# EAGLE design Si4825_KIT_SMT (EAGLE 7.5.0)
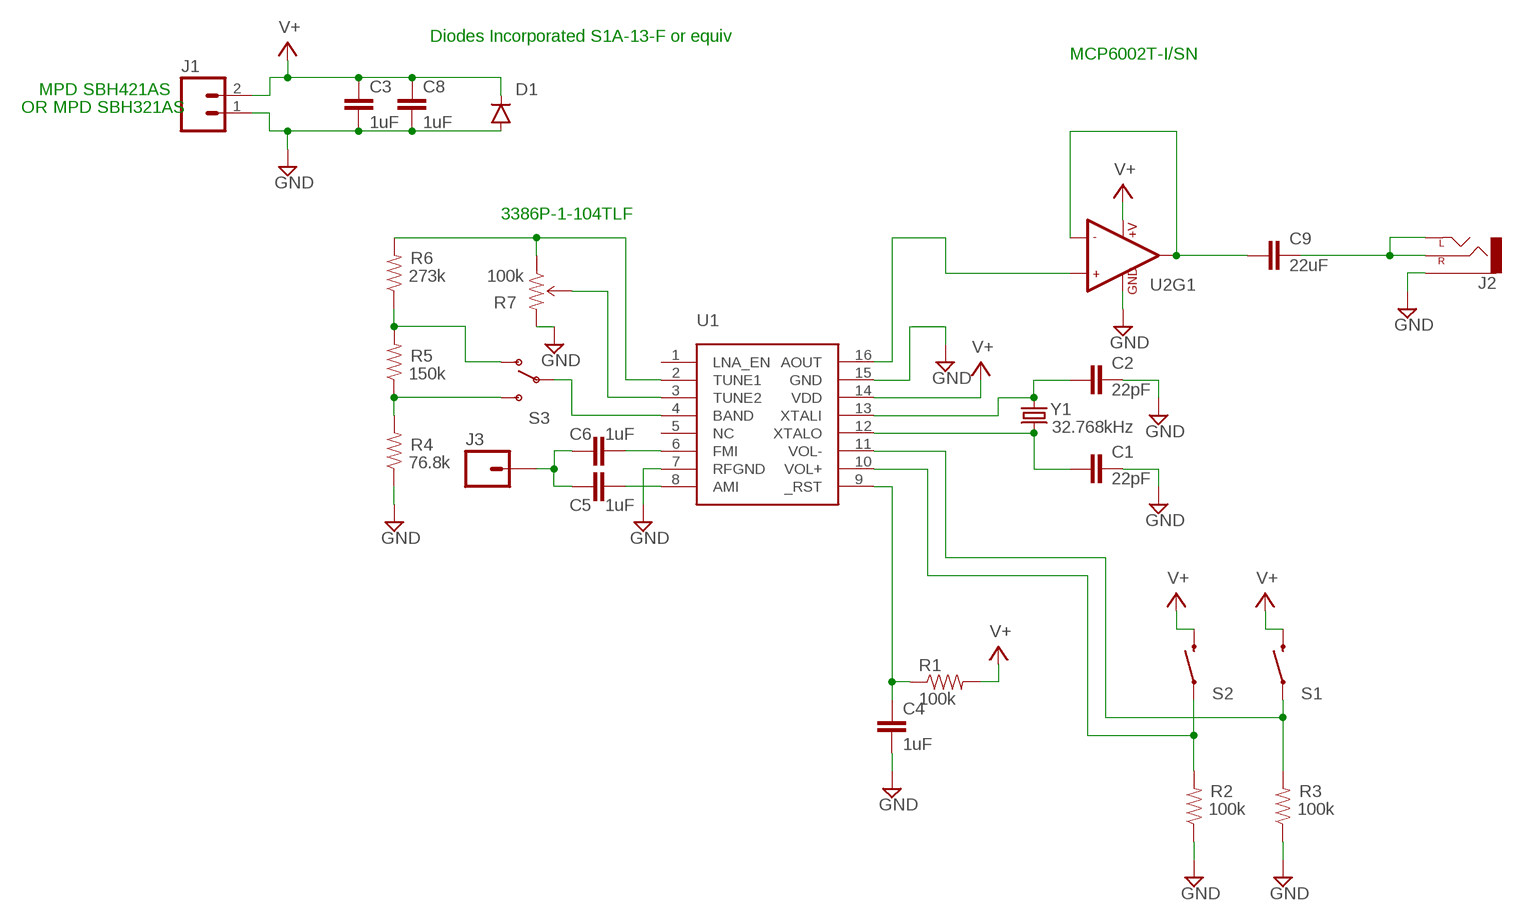
[diagram p0: schematic, sheet 1]

## Parts
C1  22pF  CAP0805  [0805]
C2  22pF  CAP0805  [0805]
C3  1uF  CAP0805  [0805]
C4  1uF  CAP0805  [0805]
C5  1uF  CAP0805  [0805]
C6  1uF  CAP0805  [0805]
C8  1uF  CAP0805  [0805]
C9  22uF  CAP0805  [0805]
D1  DIODESMA  [SMA-DIODE]
J1  M02PTH  [1X02]
J2  AUDIO-JACKPTH  [AUDIO-JACK]
J3  M01PTH  [1X01]
R1  100k  RESISTOR0805-RES  [0805]
R2  100k  RESISTOR0805-RES  [0805]
R3  100k  RESISTOR0805-RES  [0805]
R4  76.8k  RESISTOR0805-RES  [0805]
R5  150k  RESISTOR0805-RES  [0805]
R6  273k  RESISTOR0805-RES  [0805]
R7  100k  BOURNS_3386P  [BOURNS_3386P]
S1  SWITCH-MOMENTARY-2PTH  [TACTILE-PTH]
S2  SWITCH-MOMENTARY-2PTH  [TACTILE-PTH]
S3  SWITCH-SPDTPTH  [SWITCH-SPDT]
U1  SI4825  [SO16]
U2  LMV358SOIC  [SO08]
Y1  32.768kHz  CRYSTALTC26H  [TC26H]

## Nets
GND: C1.2 C2.2 C3.2 C4.2 C8.2 D1.A J1.1 J2.SLEEVE R2.1 R3.1 R4.1 R7.P$3(CW) U1.7(RFGND) U1.15(GND) U2.4(GND)
N$1: C5.2 U1.8(AMI)
N$2: C1.1 U1.12(XTALO) Y1.2
N$3: C2.1 U1.13(XTALI) Y1.1
N$4: C4.1 R1.1 U1.9(_RST)
N$5: R2.2 S2.1 U1.10(VOL+)
N$6: R3.2 S1.1 U1.11(VOL-)
N$7: S3.2(P) U1.4(BAND)
N$8: R4.2 R5.1 S3.3(S)
N$9: R5.2 R6.1 S3.1(O)
N$10: R6.2 R7.P$1(CCW) U1.2(TUNE1)
N$11: C6.2 U1.6(FMI)
N$12: R7.P$2(WIPER) U1.3(TUNE2)
N$13: C9.2 J2.RING(RIGHT) J2.TIP(LEFT)
N$14: U1.16(AOUT) U2.3(+IN1)
N$15: C5.1 C6.1 J3.1
N$17: C9.1 U2.1(OUT1) U2.2(-IN1)
V+: C3.1 C8.1 D1.C J1.2 R1.2 S1.3 S2.3 U1.14(VDD) U2.8(+V)
Unconnected: U1.1(LNA_EN) U1.5(NC) U2.5(+IN2) U2.6(-IN2) U2.7(OUT2)

## Notes on the sheet
- Diodes Incorporated S1A-13-F or equiv
- MCP6002T-I/SN
- MPD SBH421AS
- OR MPD SBH321AS
- 3386P-1-104TLF

## Library data of the parts
C1-C6 C8 C9 = SparkFun-Passives:CAP: Capacitor Standard 0603 ceramic capacitor, and 0.1" leaded capacitor.
D1 = SparkFun-DiscreteSemi:DIODE: Diode These are standard reverse protection diodes and small signal diodes. SMA package can handle up to about 1A. SOD-323 can handle about 200mA. What the SOD-323 package when ordering, there are some mfgs out there that are 5-pin packages.
J1 = SparkFun-Connectors:M02: Standard 2-pin 0.1" header. Use with - straight break away headers ( PRT-00116) - right angle break away headers (PRT-00553) - swiss pins (PRT-00743) - machine pins (PRT-00117) - female headers (PRT-00115) Molex polarized connector foot print use with: PRT-08233 with associated crimp pins and housings. 2.54_SCREWTERM for use with PRT-10571. 3.5mm Screw Terminal footprints for PRT-08084 5mm Screw Terminal footprints for use with PRT-08432
J2 = SparkFun-Connectors:AUDIO-JACK: 3.5mm Audio Jack Simple 3.5mm common PCB mount audio jack. Variant PTH is our storefront SKU PRT-08032
J3 = SparkFun-Connectors:M01: Header 1 Standard 1-pin 0.1" header. Use with straight break away headers (SKU : PRT-00116), right angle break away headers (PRT-00553), swiss pins (PRT-00743), machine pins (PRT-00117), and female headers (PRT-00115). SMTSO-256-ET is a "flush mount" nut for a 4-40 screw. The older package used to be too tight, and did not allow it to sit properly thru the drill hit. The latest (0.165DIA) fits nice and snug.
R1-R6 = SparkFun-Resistors:RESISTOR: Resistor Basic schematic elements and footprints for 0603, 1206, and PTH resistors.
R7 = Si4825:BOURNS_3386P
S1 S2 = SparkFun-Electromechanical:SWITCH-MOMENTARY-2: Various NO switches- pushbuttons, reed, etc; PROD_ID: SWCH-08441
S3 = SparkFun-Electromechanical:SWITCH-SPDT: SPDT Switch Simple slide switch, Spark Fun Electronics SKU : COM-00102 DPDT SMT slide switch, AYZ0202, SWCH-08179; PROD_ID: SWCH-08261
U1 = Si4825:SI4825
U2 = SparkFun-AnalogIC:LMV358: Jellybean rail-to-rail output op-amp; PROD_ID: IC-09657
Y1 = SparkFun-FreqCtrl:CRYSTAL: Various standard crystals. Proven footprints.; PROD_ID: XTAL-10112

## Board
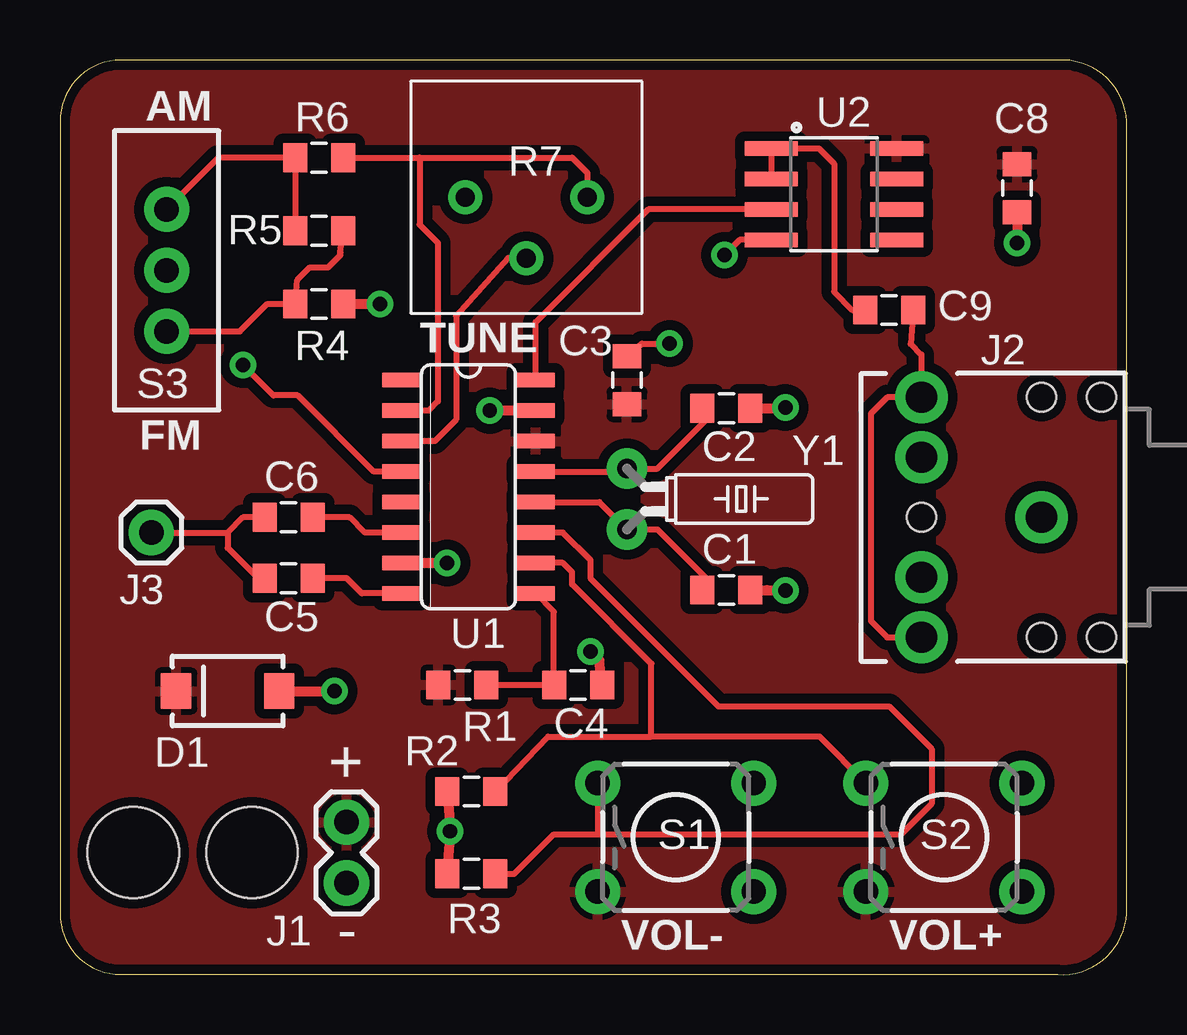
[diagram p1: board, top side]
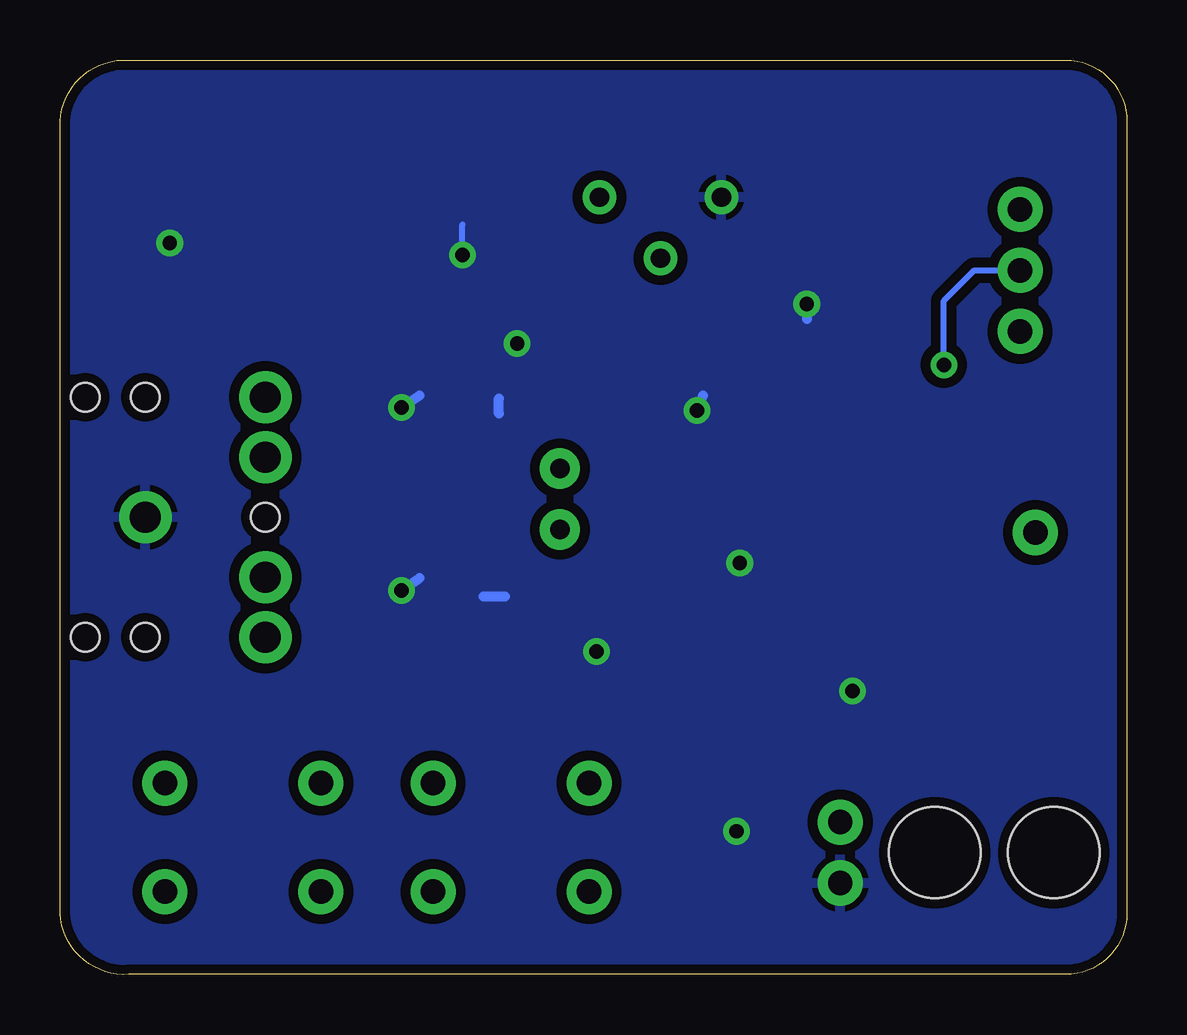
[diagram p2: board, bottom side, seen from below]

Size 44.45 x 38.11 mm. Coordinates in mm from the lower left corner, seen from the top.
Outline: 41.58,38.1 2.54,38.1 arc90 0,35.55 0,2.54 arc90 2.54,0 41.58,0 arc90 44.45,2.54 44.45,35.55 arc90 41.58,38.1
Copper layers (1*16): Top 0.035mm / dielectric 1.5mm / Bottom 0.035mm
Design rules "SparkFun": minimum track width 8mil, minimum drill 20mil, track to track 8mil, track to pad 8mil, pad to pad 8mil, via to via 8mil, smd to smd 8mil, copper to edge 10mil, drill to drill 8mil, minimum pad ring 12mil, minimum via ring 10mil, stop-mask expansion 4mil, vias tented up to drill 25mil, thermal gap 10mil
Holes 3.81 mm at 8,5.08 3.05,5.08

### Footprints (pad centres in the part's own frame; a part is rotated, then mirrored left to right if it is on the bottom)
0805 = smd 1 x 1.2: 1 -1,0; 2 1,0
SMA-DIODE = smd 1.27 x 1.47: A -2.15,0; C 2.15,0
1X02 = drill 1.016 pad 1.88: 1 0,0; 2 2.54,0
AUDIO-JACK = drill 1.3 pad 2.184: RING 5,5; RSH 5,2.5; SLEEVE 0,0; TIP 5,-5; TSH 5,-2.5 | hole 1.2: 0,5; -2.5,5; -2.5,-5; 0,-5; 5,0
1X01 = drill 1.016 pad 1.88: 1 0,0
BOURNS_3386P = drill 0.8: P$1 2.54,0; P$2 0,-2.54; P$3 -2.54,0
TACTILE-PTH = drill 1.016 pad 1.88: 1 -3.251,2.261; 2 3.251,2.261; 3 -3.251,-2.261; 4 3.251,-2.261
SWITCH-SPDT = drill 1.016 pad 1.88: 1 0,2.54; 2 0,0; 3 0,-2.54
SO16 = smd 0.6 x 1.6: 1 -4.445,-2.8; 2 -3.175,-2.8; 3 -1.905,-2.8; 4 -0.635,-2.8; 5 0.635,-2.8; 6 1.905,-2.8; 7 3.175,-2.8; 8 4.445,-2.8; 9 4.445,2.8; 10 3.175,2.8; 11 1.905,2.8; 12 0.635,2.8; 13 -0.635,2.8; 14 -1.905,2.8; 15 -3.175,2.8; 16 -4.445,2.8
SO08 = smd 0.61 x 2.21: 1 -1.905,-2.616; 2 -0.635,-2.616; 3 0.635,-2.616; 4 1.905,-2.616; 5 1.905,2.616; 6 0.635,2.616; 7 -0.635,2.616; 8 -1.905,2.616
TC26H = drill 0.813 pad 1.676: 1 -1.27,0; 2 1.27,0

### Placement (x,y rotation side)
C1  27.77,16.02 0 top
C2  27.77,23.6 0 top
C3  23.62,24.77 90 top
C4  21.59,12.07 0 top
C5  9.53,16.51 0 top
C6  9.53,19.05 0 top
C8  39.88,32.77 270 top
C9  34.54,27.69 0 top
D1  6.99,11.81 180 top
J1  11.94,3.81 90 top
J2  40.89,19.05 180 top
J3  3.81,18.42 0 top
R1  16.76,12.07 180 top
R2  17.14,7.62 0 top
R3  17.14,4.19 0 top
R4  10.79,27.94 180 top
R5  10.79,30.99 180 top
R6  10.79,34.04 0 top
R7  19.43,32.39 0 top
S1  25.65,5.72 0 top
S2  36.83,5.72 0 top
S3  4.45,29.34 0 top
U1  17.02,20.32 270 top
U2  32.26,32.52 270 top
Y1  23.62,19.82 270 top

### Tracks (layer width: path | path; a pad name or v marks a point on that pad's centre or on a via)
GND  (via drill 0.6)
  Top 0.254: U2.4 28.32,30.61 v27.69,29.98 | C3.2 24.25,26.29 v25.4,26.29
  Top 0.406: D1.A v11.43,11.81 | R4.1 v13.34,27.94 | U1.7 v16.13,17.15 | U1.15 v17.91,23.5 | C4.2 22.48,13.08 v22.1,13.47 | R2.1 16.26,6.11 v16.26,5.97 16.26,5.71 R3.1 | C2.2 29.95,23.6 v30.23,23.63 | C1.2 29.45,16.02 v30.23,16.01 | C8.2 v39.88,30.48
  Bottom 0.254: v27.69,29.98 27.69,31.25
  Bottom 0.406: v13.34,27.94 13.34,27.31 | v16.13,17.15 16.13,17.28 | v17.91,23.5 17.65,24.13 | 26.16,23.37 26.16,24.01 | 25.91,15.75 26.8,15.75 | v30.23,23.63 29.46,24.13 | v30.23,16.01 29.46,16.51 | v39.88,30.48 39.62,30.48
  pour Bottom (isolate 0.406): 0,0 44.45,0 44.45,38.1 0,38.1
N$1
  Top 0.254: U1.8 12.57,15.88 11.94,16.51 C5.2
N$2
  Top 0.254: U1.12 22.48,19.69 Y1.2 24.89,18.55 26.86,16.57 C1.1 26.86,16.06
N$3
  Top 0.254: U1.13 22.99,20.96 23.11,21.09 Y1.1 24.89,21.09 26.86,23.06 C2.1
N$4
  Top 0.254: R1.1 20.57,12.07 | 20.57,12.07 C4.1 | 20.57,12.07 C4.1 20.58,15.12 U1.9
N$5
  Top 0.254: R2.2 20.33,9.91 24.64,9.91 | 24.64,9.91 24.64,12.96 21.34,16.26 21.34,16.77 20.95,17.15 U1.10 | S2.1 31.65,9.91 24.64,9.91
N$6
  Top 0.254: 22.4,5.85 20.57,5.85 18.92,4.19 R3.2 | 22.4,5.85 35.05,5.85 36.32,7.12 36.32,9.4 34.54,11.18 27.43,11.18 22.1,16.51 22.1,17.28 20.95,18.42 U1.11 | S1.1 22.4,5.85
N$7  (via drill 0.6)
  Top 0.254: U1.4 13.08,20.96 9.91,24.13 8.89,24.13 v7.62,25.4
  Bottom 0.254: v7.62,25.4 7.62,28.07 6.35,29.34 S3.2
N$8
  Top 0.254: R5.1 11.68,30.09 11.68,29.98 11.18,29.47 10.41,29.47 9.89,28.95 R4.2 8.64,27.94 7.49,26.8 S3.3
N$9
  Top 0.254: R5.2 R6.1 6.6,34.04 S3.1
N$10
  Top 0.254: R6.2 14.99,34.04 | 14.99,34.04 21.34,34.04 21.97,33.4 R7.P$1 | U1.2 15.37,23.5 15.75,23.88 15.75,30.48 14.99,31.25 14.99,34.04
N$11
  Top 0.254: U1.6 12.7,18.42 12.06,19.05 C6.2
N$12
  Top 0.254: R7.P$2 18.67,29.85 16.51,27.44 16.51,23.12 15.62,22.23 U1.3
N$13
  Top 0.254: C9.2 35.44,26.28 35.89,25.83 J2.TIP 34.46,24.05 33.78,23.37 33.78,14.74 34.46,14.05 J2.RING
N$14
  Top 0.254: U1.16 19.82,27.19 24.51,31.88 U2.3
N$15
  Top 0.254: C5.1 8.26,16.51 6.99,17.78 6.99,18.42 | C6.1 7.62,19.05 6.99,18.42 | J3.1 6.99,18.42
N$17
  Top 0.254: U2.2 U2.1 31.62,34.42 32.26,33.79 32.26,28.45 33.02,27.69 C9.1
V+
  pour Top (isolate 0.406): 0,0 44.45,0 44.45,38.1 0,38.1

### Text on the board
tPlace: AM | TUNE | FM | + | - | VOL- | VOL+